# EAGLE design barebonesarduino (EAGLE 9.6.2)
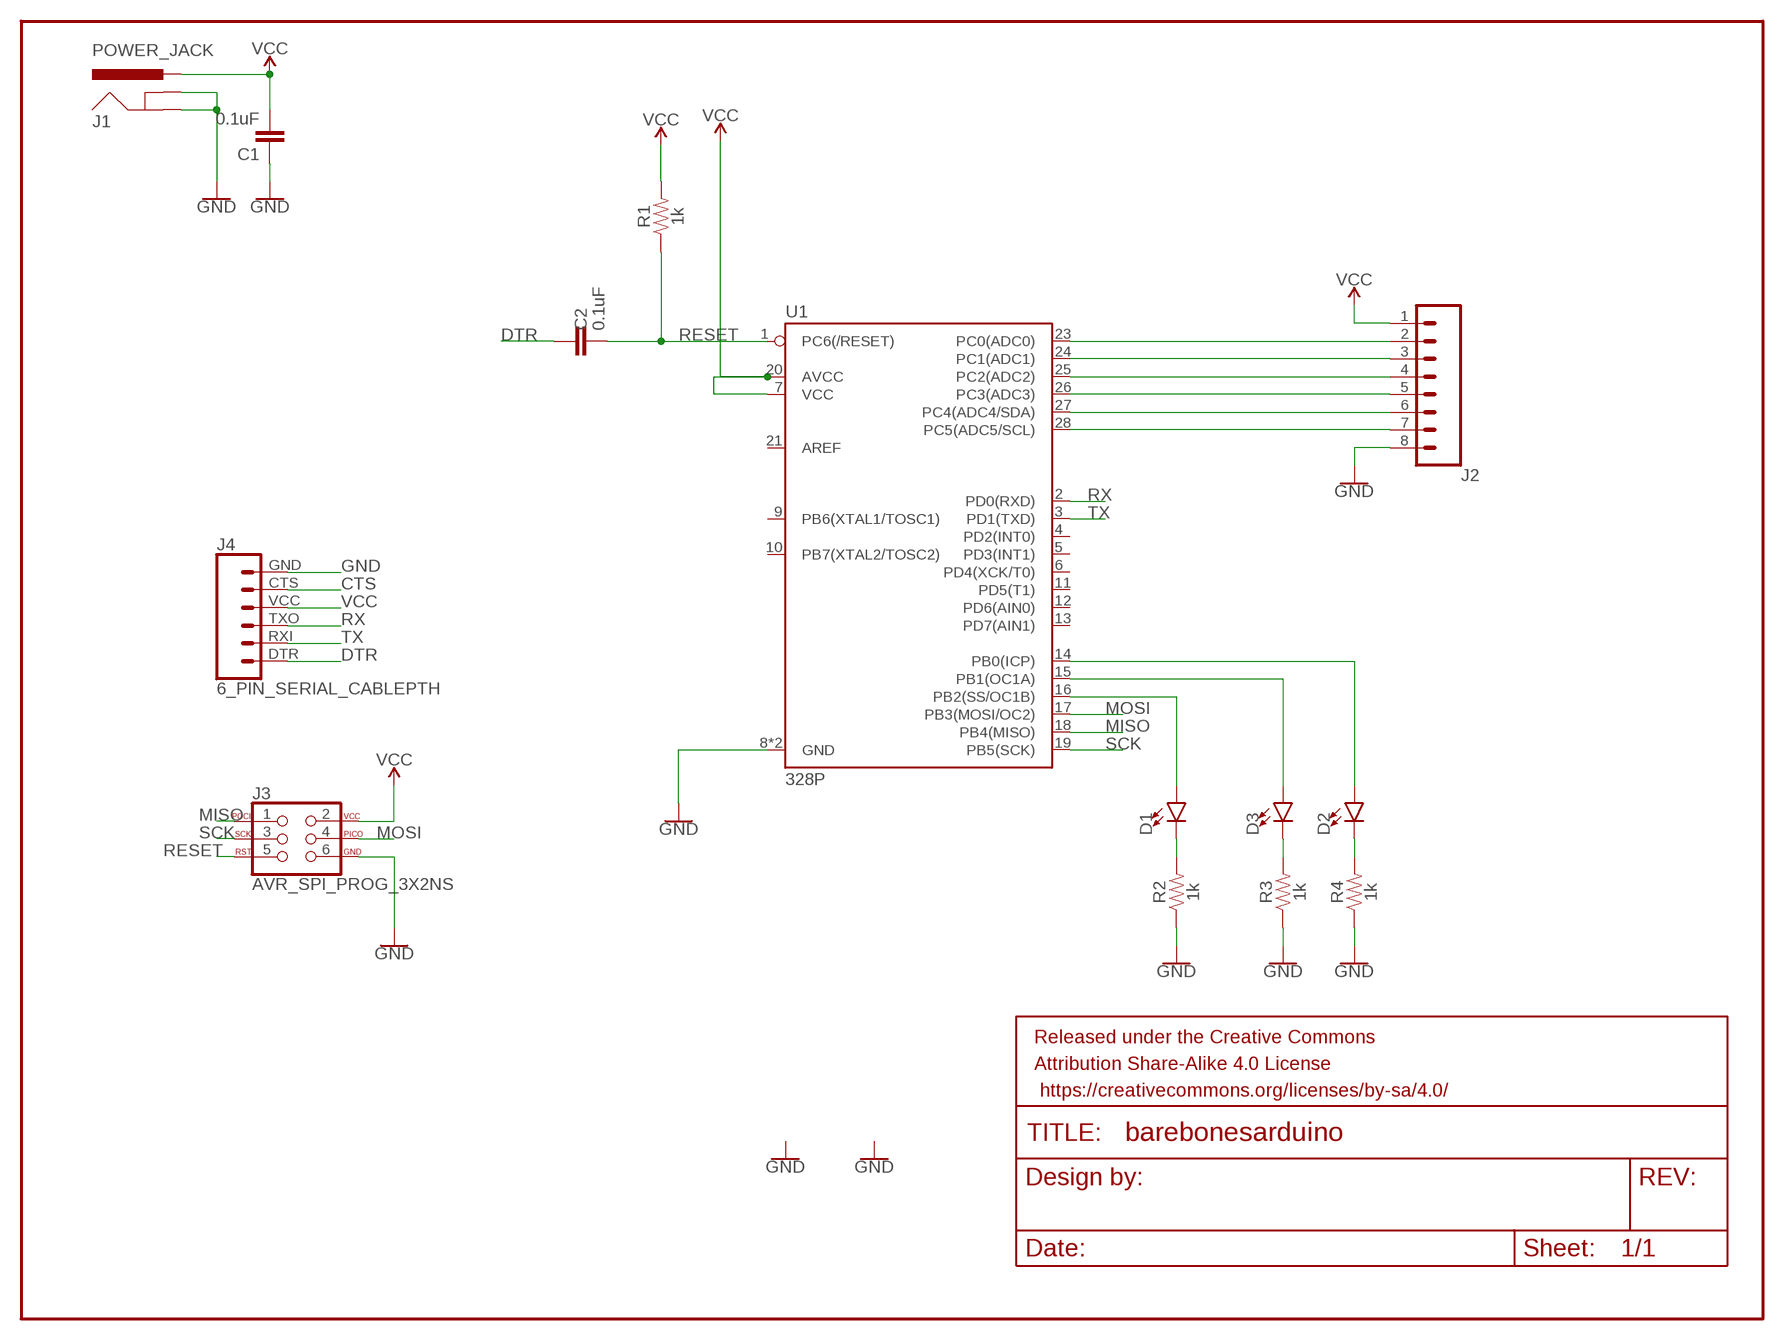
[diagram p0: schematic, sheet 1]

## Parts
C1  0.1uF  0.1UF-KIT-EZ-50V-20%  [CAP-PTH-SMALL-KIT]
C2  0.1uF  0.1UF-KIT-EZ-50V-20%  [CAP-PTH-SMALL-KIT]
D1  LED5MM  [LED_5MM]
D2  LED5MM  [LED_5MM]
D3  LED5MM  [LED_5MM]
FRAME1  FRAME-LETTER  [CREATIVE_COMMONS]
J1  POWER_JACK  [POWER_JACK_PTH]
J2  CONN_08"  [1X08]
J3  AVR_SPI_PROG_3X2NS  [2X3-NS]
J4  6_PIN_SERIAL_CABLEPTH  [FTDI_BASIC]
R1  1k  1KOHM-VERT_KIT-1/4W-1%  [AXIAL-0.1-KIT]
R2  1k  1KOHM-VERT_KIT-1/4W-1%  [AXIAL-0.1-KIT]
R3  1k  1KOHM-VERT_KIT-1/4W-1%  [AXIAL-0.1-KIT]
R4  1k  1KOHM-VERT_KIT-1/4W-1%  [AXIAL-0.1-KIT]
U1  328P  ATMEGA328P_PDIP  [DIP28]

## Nets
CTS: J4.CTS
DTR: C2.1 J4.DTR
GND: C1.1 J1.GND J1.GNDBREAK J2.8 J3.6 J4.GND R2.P$1 R3.P$1 R4.P$1 U1.8(GND) U1.22(GND)
MISO: J3.1 U1.18(PB4(MISO))
MOSI: J3.4 U1.17(PB3(MOSI/OC2))
N$2: J2.2 U1.23(PC0(ADC0))
N$3: D1.A U1.16(PB2(SS/OC1B))
N$4: D3.A U1.15(PB1(OC1A))
N$5: D2.A U1.14(PB0(ICP))
N$6: D1.K(C) R2.P$2
N$7: D3.K(C) R3.P$2
N$8: D2.K(C) R4.P$2
N$10: J2.7 U1.28(PC5(ADC5/SCL))
N$11: J2.6 U1.27(PC4(ADC4/SDA))
N$12: J2.5 U1.26(PC3(ADC3))
N$13: J2.4 U1.25(PC2(ADC2))
N$14: J2.3 U1.24(PC1(ADC1))
RESET: C2.2 J3.5 R1.P$1 U1.1(PC6(/RESET))
RX: J4.TXO U1.2(PD0(RXD))
SCK: J3.3 U1.19(PB5(SCK))
TX: J4.RXI U1.3(PD1(TXD))
VCC: C1.2 J1.PWR J2.1 J3.2 J4.VCC R1.P$2 U1.7(VCC) U1.20(AVCC)
Unconnected: U1.4(PD2(INT0)) U1.5(PD3(INT1)) U1.6(PD4(XCK/T0)) U1.9(PB6(XTAL1/TOSC1)) U1.10(PB7(XTAL2/TOSC2)) U1.11(PD5(T1)) U1.12(PD6(AIN0)) U1.13(PD7(AIN1)) U1.21(AREF)

## Library data of the parts
C1 C2 = SparkFun-Capacitors:0.1UF: 0.1µF ceramic capacitors A capacitor is a passive two-terminal electrical component used to store electrical energy temporarily in an electric field.; PROD_ID: CAP-08370
D1-D3 = SparkFun-LED:LED: LED (Generic) Standard schematic elements and footprints for 5mm, 3mm, 1206, and 0603 sized LEDs. Generic LEDs with no color specified.
FRAME1 = SparkFun-Aesthetics:FRAME-LETTER: Schematic Frame - Letter Standard 8.5x11 US Letter frame
J1 = SparkFun-Connectors:POWER_JACK: Power Jack Connector This is the standard 5.5mm barrel jack for power. The PTH is the most common, proven, reliable, footprint. The Slot footprint only works if the mill layer is transmitted to the PCB fab house so be warned. Here are the connectors we sell at SparkFun: DC Barrel Power Jack/Connector <https://www.sparkfun.com/products/119> (PRT-00119) DC Barrel Power Jack/Connector (SMD) <https://www.sparkfun.com/products/12748> (PRT-12748) DC Barrel Jack Adapter - Breadboard Compatible <https://www.sparkfun.com/products/10811> (PRT-10811) It is used on this SparkFun product (and many, many others): SparkFun RedBoard - Programmed with Arduino <https://www.sparkfun.com/products/12757> (DEV-12757) Also, if you need a mating power supply or connector, please check these out: Wall Adapter Power Supply - 9VDC 650mA <https://www.sparkfun.com/products/298> (TOL-00298) DC Barrel Jack Adapter - Male <https://www.sparkfun.com/products/10287> (PRT-10287); PROD_ID: CONN-08197
J2 = SparkFun-Connectors:CONN_08: Multi connection point. Often used as Generic Header-pin footprint for 0.1 inch spaced/style header connections On any of the 0.1 inch spaced packages, you can populate with these: Break Away Headers - Straight <https://www.sparkfun.com/products/116> (PRT-00116) Break Away Male Headers - Right Angle <https://www.sparkfun.com/products/553> (PRT-00553) Female Headers <https://www.sparkfun.com/products/115> (PRT-00115) Break Away Headers - Machine Pin <https://www.sparkfun.com/products/117> (PRT-00117) Break Away Female Headers - Swiss Machine Pin <https://www.sparkfun.com/products/743> (PRT-00743) Arduino Stackable Header - 8 Pin <https://www.sparkfun.com/products/9279> (PRT-09279) For SCREWTERMINALS and SPRING TERMINALS visit here: Screw Terimnals on SparkFun.com <https://www.sparkfun.com/search/results?term=Screw+Terminals> (5mm/3.5mm/2.54mm spacing) This device is also useful as a general connection point to wire up your design to another part of your project. Our various solder wires solder well into these plated through hole pads. Hook-Up Wire - Assortment (Stranded, 22 AWG) <https://www.sparkfun.com/products/11375> (PRT-11375) Hook-Up Wire - Assortment (Solid Core, 22 AWG) <https://www.sparkfun.com/products/11367> (PRT-11367) View the entire wire category on our website here <https://www.sparkfun.com/categories/141> Special notes: Molex polarized connector foot print use with SKU : PRT-08231 with associated crimp pins and housings. 1MM SMD Version SKU: PRT-10208 NOTES ON THE VARIANTS LOCK and LOCK_LONGPADS... This footprint was designed to help hold the alignment of a through-hole component (i.e. 6-pin header) while soldering it into place. You may notice that each hole has been shifted either up or down by 0.005 of an inch from it's more standard position (which is a perfectly straight line). This slight alteration caused the pins (the squares in the middle) to touch the edges of the holes. Because they are alternating, it causes a "brace" to hold the component in place. 0.005 has proven to be the perfect amount of "off-center" position when using our standard breakaway headers. Although looks a little odd when you look at the bare footprint, once you have a header in there, the alteration is very hard to notice. Also,if you push a header all the way into place, it is covered up entirely on the bottom side.; PROD_ID: CONN-08438
J3 = SparkFun-Connectors:AVR_SPI_PROG_3X2: AVR ISP 6 Pin This is the reduced ISP connector for AVR programming. Common on Arduino. This footprint will take up less PCB space and can be used with a 10-pin to 6-pin adapter such as SKU: BOB-08508 **Special note about "TEST_POINT" package. The stop mask is on the top side, so if you want your programming test points to be on the bottom of your board, make sure to place this package on the bottom side of the board. This also ensure that the orientation to program from the bottom side will be correct. SparkFun Products: SparkFun ISP Pogo Adapter <https://www.sparkfun.com/products/11591> - NS Tiny AVR Programmer <https://www.sparkfun.com/products/11801> -PTH
J4 = SparkFun-Connectors:6_PIN_SERIAL_CABLE: 6-pin header connection for use with the "FTDI BASIC" pinout - CABLE SIDE. Also known as "Arduino Serial Program Header". This is used on a design to provide a 6-pin connection point for serial communication usually from a USB cable (D+/D-) to these headers (RX/TX). It also has the remaining pins necessary for programming in the Arduino evironment (DTR, GND, and sometimes VCC). Note, this device has "CABLE" in the name. It is intended to be used on a design that usually lives on the end of your USB cable and prvides the converter chip (FTDI232 or FTDI231x) to commnicate serial RX/TX. The "sister" device, named "TARGET" is inteneded to be used on a design that contains a target micro-controller that you wish to program. You can populate with some of these: Female Headers <https://www.sparkfun.com/products/115> (PRT-00115) For reference (or to suit your programming needs) check out these designs: SparkFun FTDI Basic Breakout - 5V <https://www.sparkfun.com/products/9716> (DEV-09716) SparkFun FTDI Basic Breakout - 3.3V <https://www.sparkfun.com/products/9873> (DEV-09873) SparkFun FTDI SmartBasic <https://www.sparkfun.com/products/12935> (DEV-12935) SparkFun Beefy 3 - FTDI Basic Breakout <https://www.sparkfun.com/products/13746> (DEV-13746)
R1-R4 = SparkFun-Resistors:1KOHM: 1kΩ resistor A resistor is a passive two-terminal electrical component that implements electrical resistance as a circuit element. Resistors act to reduce current flow, and, at the same time, act to lower voltage levels within circuits. - Wikipedia; PROD_ID: RES-12182
U1 = SparkFun-IC-Microcontroller:ATMEGA328P_PDIP: Atmel 328P Through hole ATMEGA328P uC used in the Arduino 32kb flash, 1k EEPROM, 2k SRAM Datasheet <http://www.sparkfun.com/datasheets/Components/SMD/ATMega328.pdf> SparkFun Products Storefront component: AVR 28 Pin 20MHz 32K 6A/D - ATMega328P <https://www.sparkfun.com/products/9061> (COM-09061) SparkFun Simon Says - Through-Hole Soldering Kit <https://www.sparkfun.com/products/10547> (KIT-10547) SparkFun Learn to Solder - Simon Says <https://www.sparkfun.com/products/13708> (KIT-13708) SparkFun BigTime Watch Kit <https://www.sparkfun.com/products/11734> (KIT-11734) SparkFun ClockIt <https://www.sparkfun.com/products/10930> (KIT-10930) SparkFun Serial Enabled LCD Kit <https://www.sparkfun.com/products/10097> (LCD-10097) SparkFun Simon Tilts - Through Hole Soldering Kit <https://www.sparkfun.com/products/12634> (KIT-12634) SparkFun Frequency Counter Kit <https://www.sparkfun.com/products/10140> (KIT-10140) FabFM Radio Kit <https://www.sparkfun.com/products/11043> (KIT-11043) SparkFun Binary Blaster Kit <https://www.sparkfun.com/products/12037> (KIT-12037) SparkFun Metro-Gnome <https://www.sparkfun.com/products/9236> (KIT-09236) ATmega328 with Arduino Optiboot (Uno) <https://www.sparkfun.com/products/10524> (DEV-10524); PROD_ID: IC-09136

## Board
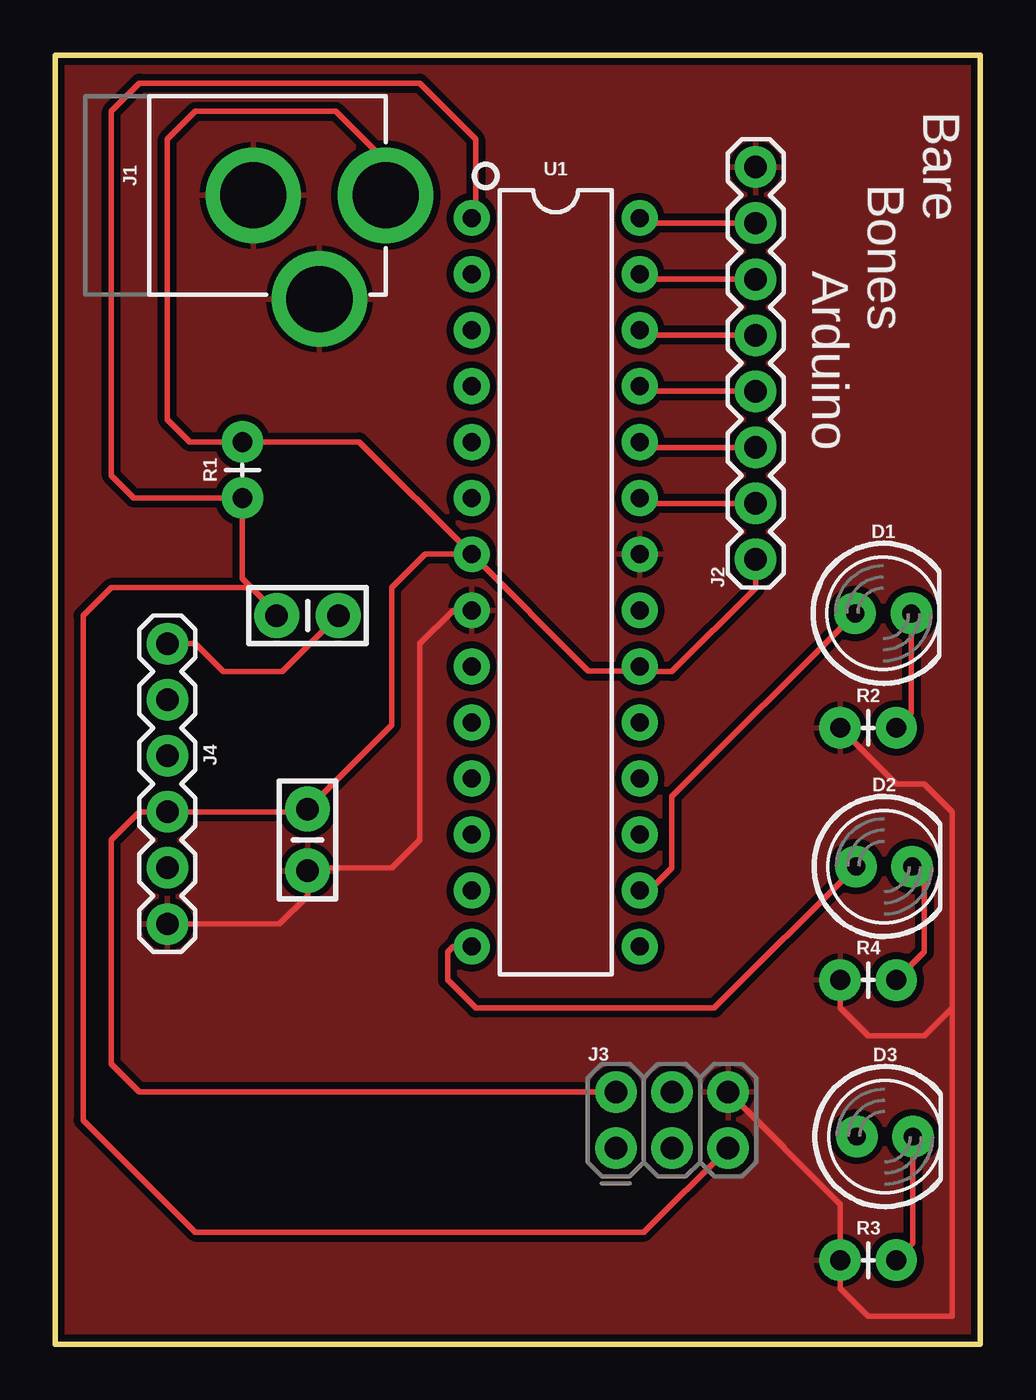
[diagram p1: board, top side]
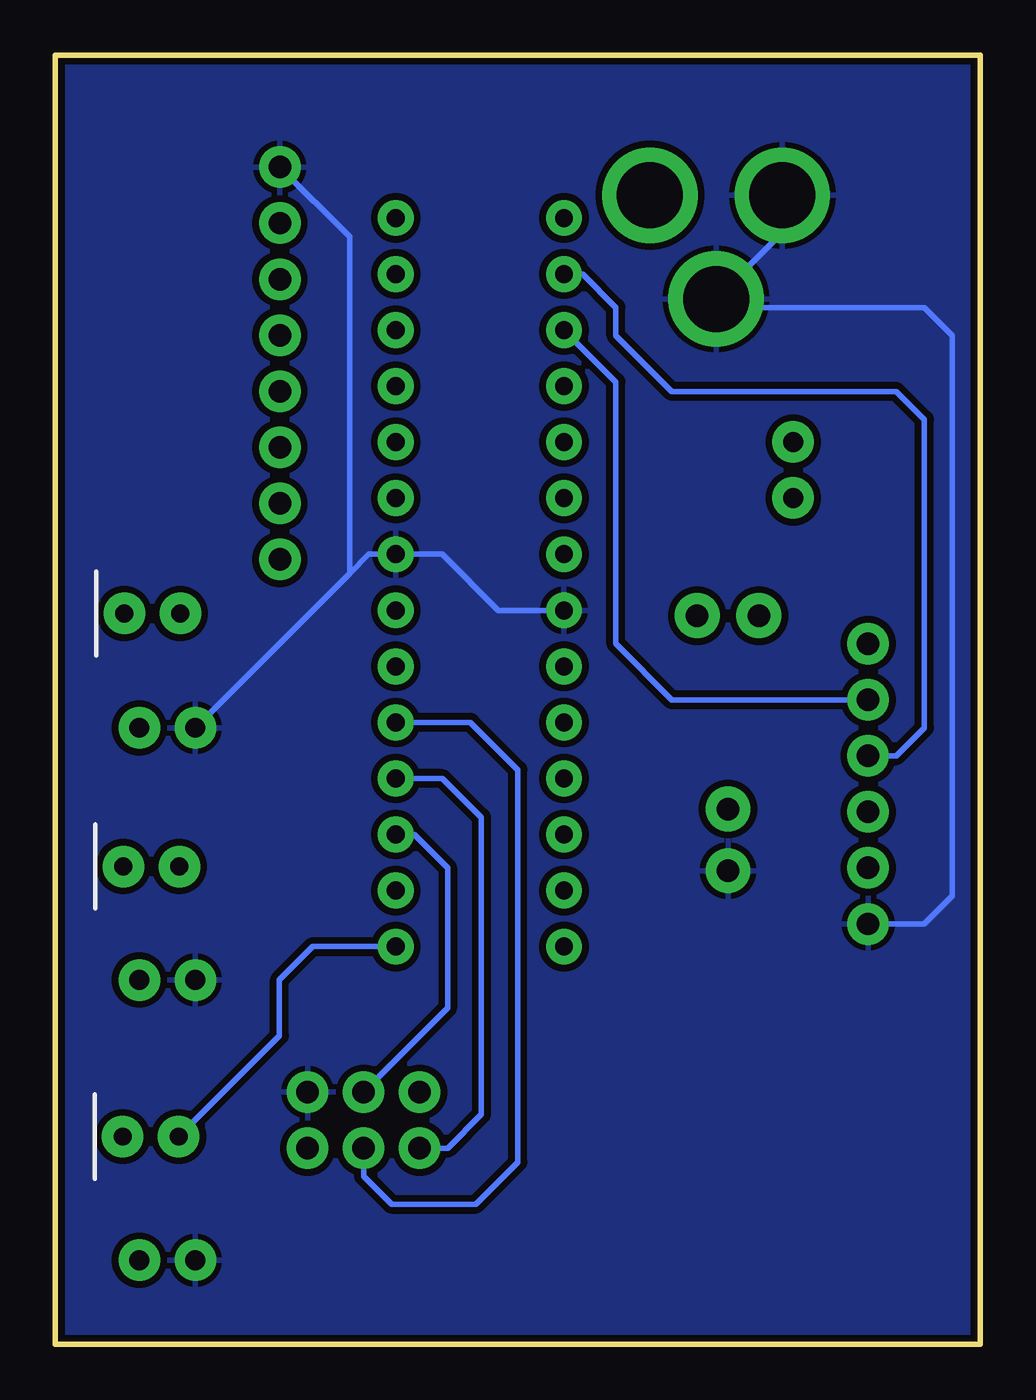
[diagram p2: board, bottom side, seen from below]

Size 41.91 x 58.42 mm. Coordinates in mm from the lower left corner, seen from the top.
Outline: 0,0 0,58.42 41.91,58.42 41.91,0 0,0
Copper layers (1*16): Top 0.035mm / dielectric 1.5mm / Bottom 0.035mm
Design rules "SparkFun": minimum track width 8mil, minimum drill 20mil, track to track 8mil, track to pad 8mil, pad to pad 8mil, via to via 8mil, smd to smd 8mil, copper to edge 8mil, drill to drill 8mil, minimum pad ring 12mil, minimum via ring 10mil, stop-mask expansion 4mil, vias tented up to drill 20mil, thermal gap 10mil

### Footprints (pad centres in the part's own frame; a part is rotated, then mirrored left to right if it is on the bottom)
CAP-PTH-SMALL-KIT = drill 1.016 pad 2.032: 1 -1.397,0; 2 1.397,0
LED_5MM = drill 0.813 pad 1.88: A -1.27,0; K 1.27,0
POWER_JACK_PTH = drill 2.997 pad 4.318: GND 0,7.7; GNDBREAK 4.7,10.7; PWR 0,13.7
1X08 = drill 1.016 pad 1.88: 1 0,0; 2 2.54,0; 3 5.08,0; 4 7.62,0; 5 10.16,0; 6 12.7,0; 7 15.24,0; 8 17.78,0
2X3-NS = drill 1.016 pad 1.88: 1 -2.54,-1.27; 2 -2.54,1.27; 3 0,-1.27; 4 0,1.27; 5 2.54,-1.27; 6 2.54,1.27
FTDI_BASIC = drill 1.016 pad 1.88: CTS 10.16,0; DTR 0,0; GND 12.7,0; RXI 2.54,0; TXO 5.08,0; VCC 7.62,0
AXIAL-0.1-KIT = drill 0.9 pad 1.88: P$1 -1.27,0; P$2 1.27,0
DIP28 = drill 0.813 pad 1.626: 1 -16.51,-3.81; 2 -13.97,-3.81; 3 -11.43,-3.81; 4 -8.89,-3.81; 5 -6.35,-3.81; 6 -3.81,-3.81; 7 -1.27,-3.81; 8 1.27,-3.81; 9 3.81,-3.81; 10 6.35,-3.81; 11 8.89,-3.81; 12 11.43,-3.81; 13 13.97,-3.81; 14 16.51,-3.81; 15 16.51,3.81; 16 13.97,3.81; 17 11.43,3.81; 18 8.89,3.81; 19 6.35,3.81; 20 3.81,3.81; 21 1.27,3.81; 22 -1.27,3.81; 23 -3.81,3.81; 24 -6.35,3.81; 25 -8.89,3.81; 26 -11.43,3.81; 27 -13.97,3.81; 28 -16.51,3.81

### Placement (x,y rotation side)
C1  11.43,22.86 90 top
C2  11.43,33.02 180 top
D1  37.51,33.13 0 top
D2  37.55,21.65 0 top
D3  37.59,9.41 0 top
FRAME1  15.24,60.96 0 top
J1  1.27,52.07 270 top
J2  31.73,35.57 90 top
J3  27.94,10.16 0 top
J4  5.08,31.75 270 top
R1  8.48,39.62 90 top
R2  36.83,27.94 0 top
R3  36.83,3.81 0 top
R4  36.83,16.51 0 top
U1  22.67,34.53 270 top

### Tracks (layer width: path | path; a pad name or v marks a point on that pad's centre or on a via)
DTR
  Top 0.254: C2.1 10.29,30.48 7.62,30.48 6.35,31.75 J4.DTR
GND
  Top 0.254: J4.GND 10.16,19.05 11.43,20.32 C1.1 11.56,21.59 15.24,21.59 16.51,22.86 16.51,31.75 18.02,33.26 U1.8 | R2.P$1 38.1,25.4 39.37,25.4 40.64,24.13 40.64,15.24 | 40.64,15.24 39.37,13.97 36.83,13.97 35.56,15.24 R4.P$1 | 40.64,15.24 40.64,1.27 36.83,1.27 35.56,2.54 R3.P$1 35.56,6.35 J3.6
  Bottom 0.254: J1.GND 8.97,50.37 J1.GNDBREAK 11.81,47.37 11.43,46.99 2.54,46.99 1.27,45.72 1.27,20.32 2.54,19.05 J4.GND | U1.8 21.83,33.26 24.37,35.8 U1.22 27.7,35.8 28.57,34.92 | R2.P$1 28.57,34.92 | J2.8 28.57,50.19 28.57,34.92
  pour Top (isolate 0.305): 0,0 0,58.42 41.91,58.42 41.91,0
  pour Bottom (isolate 0.305): 0,0 0,58.42 41.91,58.42 41.91,0
MISO
  Bottom 0.254: U1.18 24.37,25.64 22.61,23.88 22.61,10.41 24.13,8.89 J3.1
MOSI
  Bottom 0.254: J3.4 24.13,15.24 24.13,21.59 25.64,23.1 U1.17
N$2
  Top 0.254: J2.2 26.72,38.11 U1.23
N$3
  Top 0.254: D1.A 27.94,24.82 27.94,21.59 26.91,20.56 U1.16
N$4
  Bottom 0.254: D3.A 31.75,13.98 31.75,16.51 30.24,18.02 U1.15
N$5
  Top 0.254: D2.A 29.87,15.24 19.05,15.24 17.78,16.51 17.78,17.78 18.02,18.02 U1.14
N$6
  Top 0.254: D1.K 38.78,28.62 R2.P$2
N$7
  Top 0.254: D3.K 38.86,4.57 R3.P$2
N$8
  Top 0.254: D2.K 39.37,21.11 39.37,17.78 R4.P$2
N$10
  Top 0.254: J2.7 26.72,50.81 U1.28
N$11
  Top 0.254: J2.6 26.72,48.27 U1.27
N$12
  Top 0.254: J2.5 26.68,45.73 26.67,45.72 26.48,45.91 U1.26
N$13
  Top 0.254: J2.4 26.72,43.19 U1.25
N$14
  Top 0.254: J2.3 26.72,40.65 U1.24
RESET
  Top 0.254: J3.5 26.67,5.08 6.35,5.08 1.27,10.16 1.27,33.02 2.54,34.29 8.89,34.29 | C2.2 10.03,33.15 8.89,34.29 | 8.89,34.29 8.48,34.7 R1.P$1 3.56,38.35 2.54,39.37 2.54,55.88 3.81,57.15 16.51,57.15 19.05,54.61 19.05,51.23 U1.1
RX
  Bottom 0.254: J4.TXO 3.81,26.67 2.54,27.94 2.54,41.91 3.81,43.18 13.97,43.18 16.51,45.72 16.51,46.99 18.02,48.5 U1.2
SCK
  Bottom 0.254: U1.19 23.1,28.18 20.95,26.04 20.95,8.26 22.86,6.35 26.67,6.35 27.94,7.62 J3.3
TX
  Bottom 0.254: J4.RXI 13.97,29.21 16.51,31.75 16.51,43.61 U1.3
VCC
  Top 0.254: J3.2 3.81,11.43 2.54,12.7 2.54,22.86 3.81,24.13 J4.VCC 11.3,24.13 C1.2 15.24,28.07 15.24,34.29 16.75,35.8 U1.7 | J2.1 31.73,34.27 27.94,30.48 26.73,30.48 26.7,30.51 | 26.7,30.51 U1.20 | U1.7 13.77,40.89 R1.P$2 6.1,40.89 5.08,41.91 5.08,54.61 6.35,55.88 12.7,55.88 14.97,53.61 J1.PWR | U1.7 24.16,30.51 26.7,30.51

### Text on the board
tPlace: Bare / Bones / Arduino